# EasyEDA Pro project FOC的开关电源模块.eprj

# Schematic Schematic1
Board Name: Board1; Create Date: 2024-10-08; Page Name: P1; Project Name: FOC的开关电源模块; Schematic Name: Schematic1; Update Date: 2024-10-20; Company: 嘉立创EDA; Page Size: A4; Version: V1.0
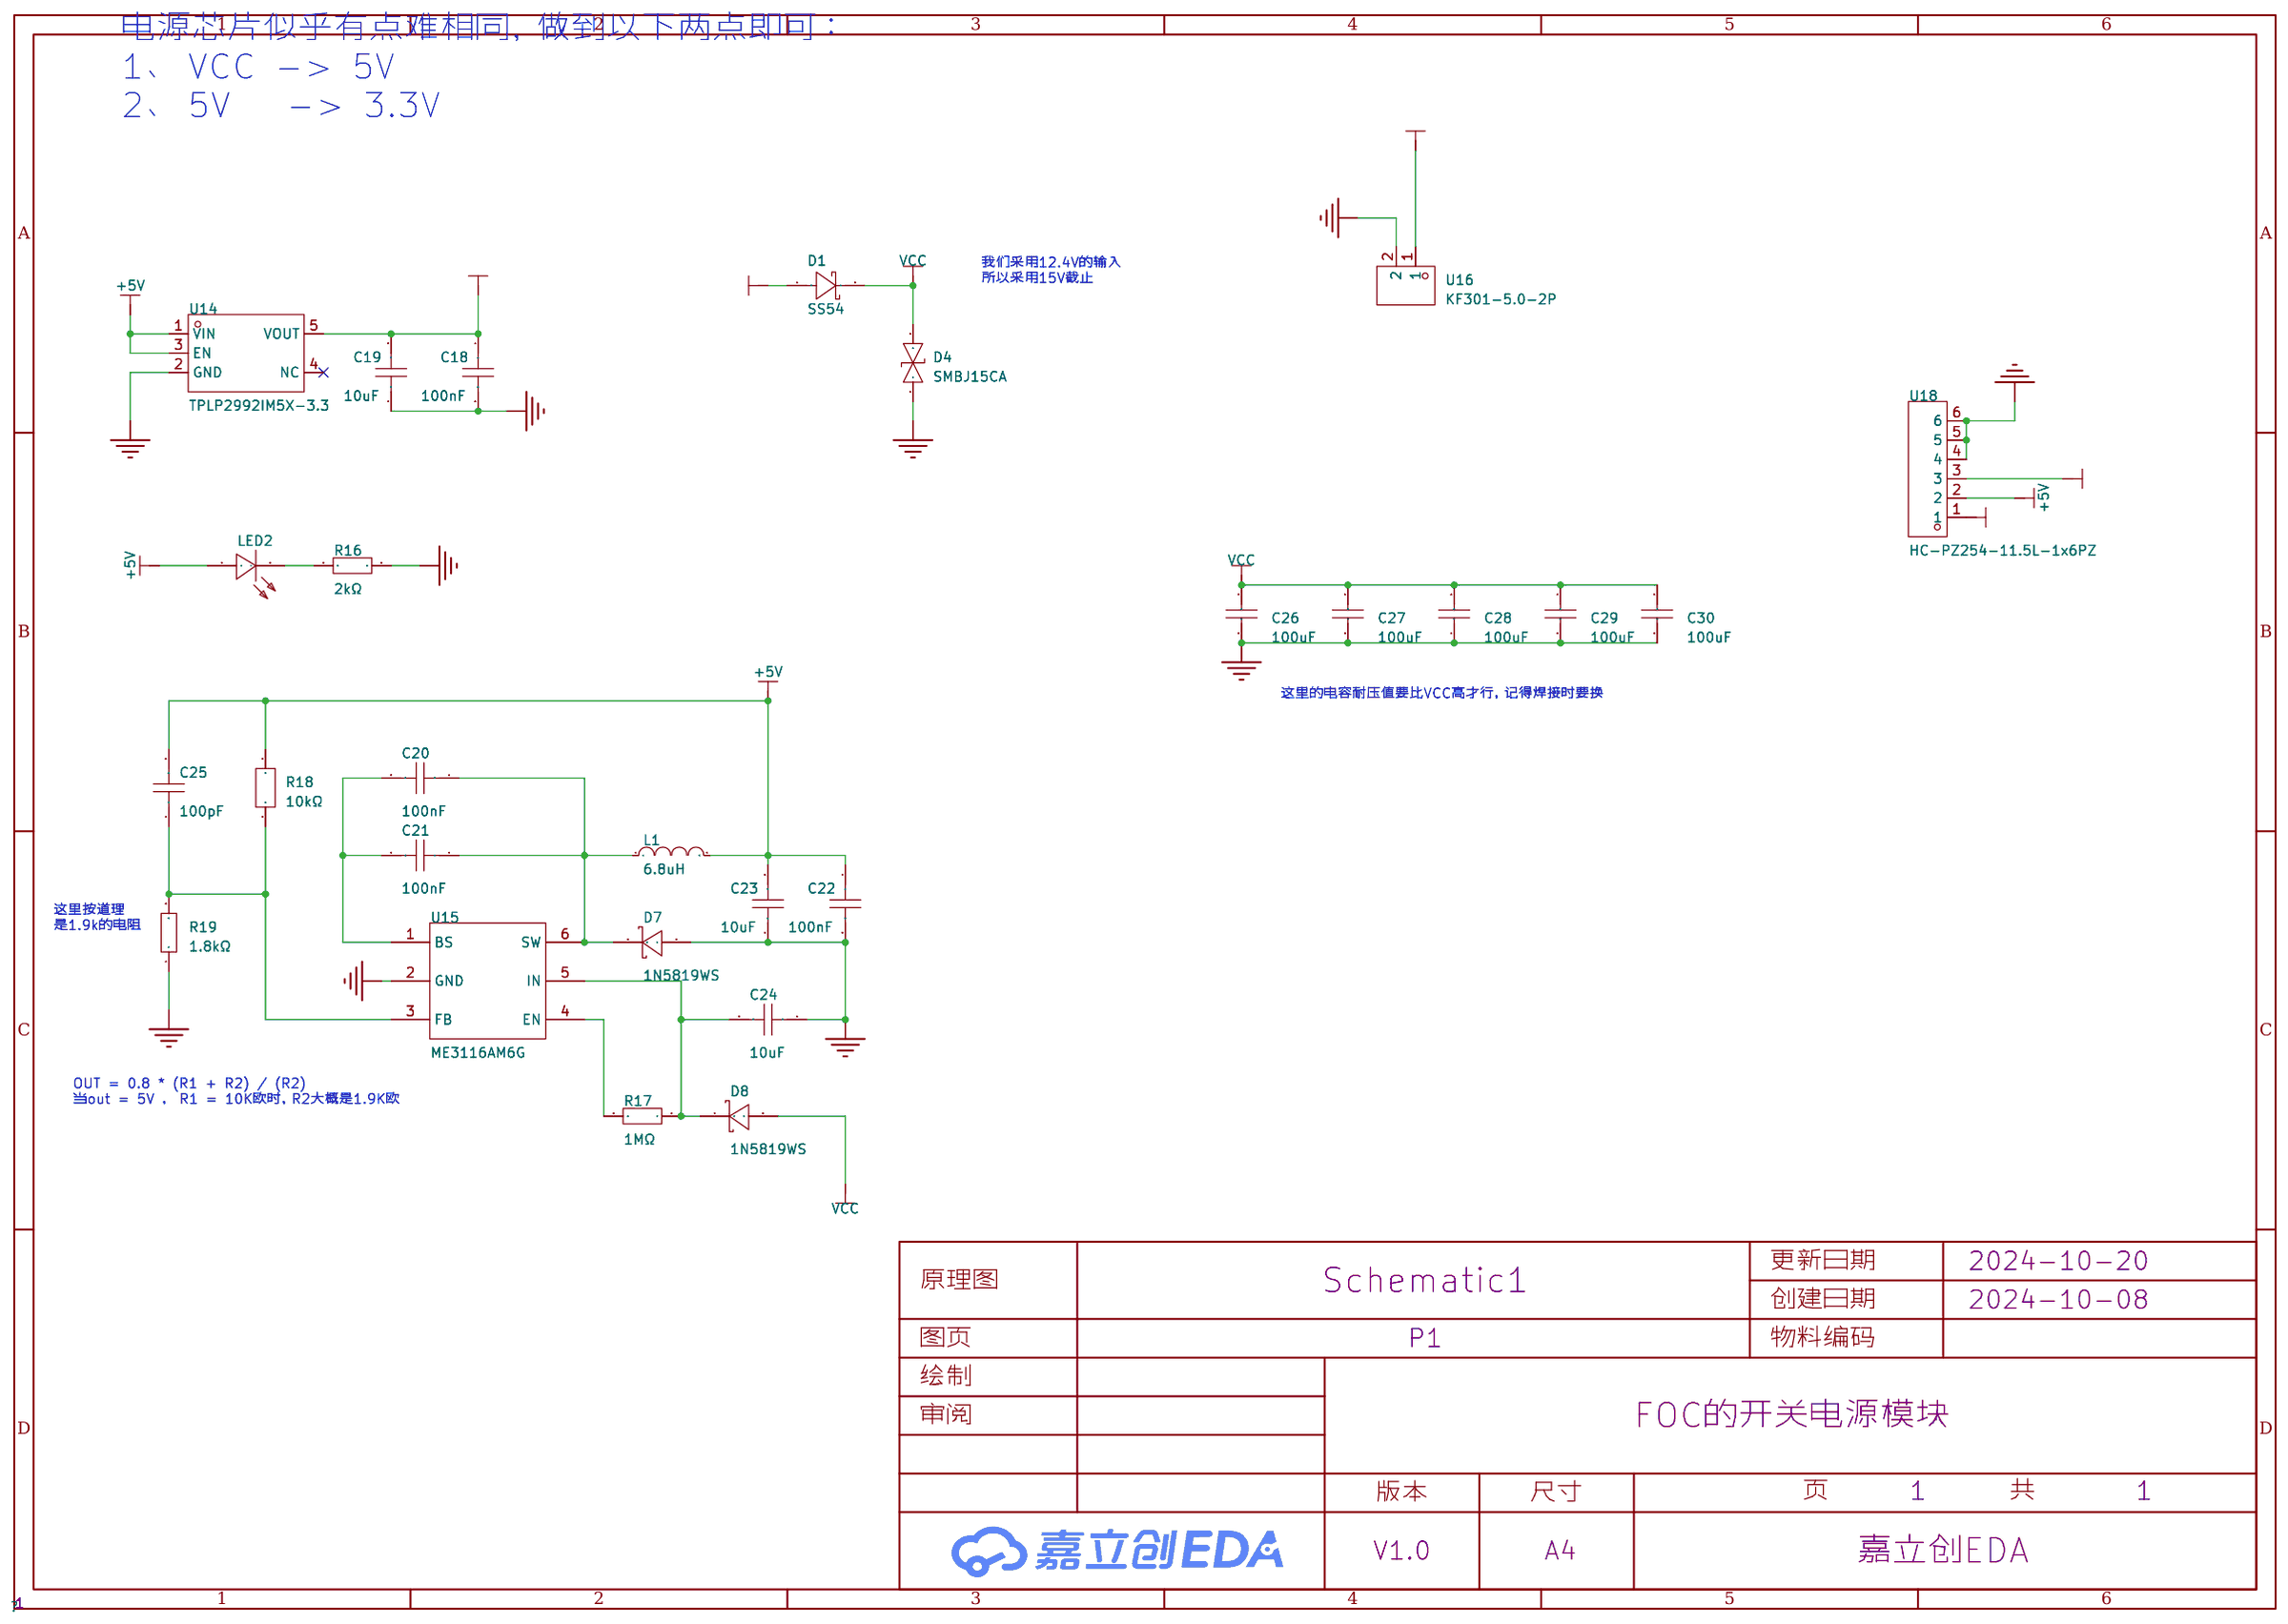
[diagram p0: schematic sheet]

## Parts
C18  100nF  [C0603]
C19  10uF  [C0603]
C20  100nF  [C0603]
C21  100nF  [C0603]
C22  100nF  [C0603]
C23  10uF  [C0603]
C24  10uF  [C0603]
C25  100pF  [C0603]
C26  100uF  [C1206]
C27  100uF  [C1206]
C28  100uF  [C1206]
C29  100uF  [C1206]
C30  100uF  [C1206]
D1  SS54  [SMA_L4.3-W2.6-LS5.0-FD]
D4  SMBJ15CA  [SMB_L4.6-W3.6-LS5.3-BI]
D7  1N5819WS  [SOD-323_L1.8-W1.3-LS2.5-RD]
D8  1N5819WS  [SOD-323_L1.8-W1.3-LS2.5-RD]
L1  6.8uH  [IND-SMD_L3.2-W2.5_L3225]
LED2  SZYY0805G  [LED0805-R-RD]
R16  2kΩ  [R0603]
R17  1MΩ  [R0603]
R18  10kΩ  [R0603]
R19  1.8kΩ  [R0603]
U14  TPLP2992IM5X-3.3  [SOT-23-5_L2.9-W1.6-P0.95-LS2.8-BL]
U15  ME3116AM6G  [SOT-23-6_L2.9-W1.6-P0.95-LS2.8-BL]
U16  KF301-5.0-2P  [CONN-TH_P5.00_KF301-5.0-2P]
U18  HC-PZ254-11.5L-1x6PZ  [hdr-th_6p-p2.54-v-f]

## Library data of the parts
C18 C20-C22 = CGA0603X7R104K500JT: 容值:100nF;精度:±10%;额定电压:50V;材质(温度系数):X7R;; LCSC Part Name: 100nF ±10% 50V; Supplier Part: C6119867; Manufacturer: HRE(芯声); Supplier Footprint: 0603; JLCPCB Part Class: 扩展库; Supplier: LCSC; Tolerance: ±10%; Voltage Rated: 50V; Temperature Coefficient: X7R
C19 C23 C24 = GRM188R6YA106MA73D: 容值:10uF;精度:±20%;额定电压:35V;材质(温度系数):X5R;; LCSC Part Name: 10uF ±20% 35V; Supplier Part: C194427; Manufacturer: muRata(村田); Supplier Footprint: 0603; JLCPCB Part Class: 扩展库; Datasheet: https://atta.szlcsc.com/upload/public/pdf/source/20210128/C194427_FCA3640823207DDB58700A82F1A19B5F.pdf; Supplier: LCSC; Tolerance: ±20%; Voltage Rated: 35V; Temperature Coefficient: X5R
C25 = CC0603JRNPO9BN101: 容值:100pF;精度:±5%;额定电压:50V;材质(温度系数):NP0;; LCSC Part Name: 100pF ±5% 50V; Supplier Part: C14665; Manufacturer: YAGEO(国巨); Supplier Footprint: 0603; JLCPCB Part Class: 扩展库; Datasheet: https://atta.szlcsc.com/upload/public/pdf/source/20181008/C309499_21CC21451B82C39E3D92150FD6B30293.pdf; Supplier: LCSC; Tolerance: ±5%; Voltage Rated: 50V; Temperature Coefficient: NP0
C26-C30 = C3216X5R1A107MT0A0E: 容值:100uF;精度:±20%;额定电压:10V;材质(温度系数):X5R;; LCSC Part Name: 100uF ±20% 10V; Supplier Part: C76656; Manufacturer: TDK; Supplier Footprint: 1206; JLCPCB Part Class: 扩展库; Datasheet: https://atta.szlcsc.com/upload/public/pdf/source/20191009/C435256_A698304126E0DD2EAD15F9D05758F127.pdf; Supplier: LCSC; Tolerance: ±20%; Voltage Rated: 10V; Temperature Coefficient: X5R
D1 = SS54_C7420369: 二极管配置:独立式;正向压降(Vf):550mV@5.0A;直流反向耐压(Vr):40V;整流电流:5A;; LCSC Part Name: 电压:40V 电流:5A; Supplier Part: C7420369; Manufacturer: 宏迦橙; Supplier Footprint: SMA(DO-214AC); JLCPCB Part Class: 扩展库; Datasheet: https://atta.szlcsc.com/upload/public/pdf/source/20230828/254C3882F8647358AD9F60DD73611B5E.pdf; Supplier: LCSC; Diode Configuration: 独立式; Forward Voltage (Vf@If): 550mV@5.0A; Reverse Voltage (Vr): 40V; Rectified Current: 5A; Reverse Leakage Current (Ir): 50uA@40V
D4 = SMBJ15CA_C113989: 极性:单向;反向截止电压(Vrwm):15V;最大钳位电压:24.4V;峰值脉冲电流(Ipp)@10/1000us:24A;击穿电压:16.7V;; LCSC Part Name: TVS 15V截止 24.6A峰值脉冲; Supplier Part: C113989; Manufacturer: MDD; Supplier Footprint: SMB(DO-214AA); JLCPCB Part Class: 扩展库; Datasheet: https://atta.szlcsc.com/upload/public/pdf/source/20230314/C8F66EF07395B88C11214ABD10019202.pdf; Supplier: LCSC; polarity: 单向; Reverse Stand-Off Voltage (Vrwm): 15V; Maximum Clamping Voltage: 24.4V; Peak Pulse Current (Ipp)@10/1000us: 24A; Breakdown Voltage: 16.7V; Type: TVS
D7 D8 = 1N5819WS_C191023: 正向压降(Vf):600mV@1A;直流反向耐压(Vr):40V;平均整流电流(Io):1A;; LCSC Part Name: 电压:40V 电流:1A; Supplier Part: C191023; Manufacturer: Hottech(合科泰); Supplier Footprint: SOD-323; JLCPCB Part Class: 基础库; Datasheet: https://atta.szlcsc.com/upload/public/pdf/source/20220428/3CB86FD8D28D653594B4E35F9D5AEFD9.pdf; Supplier: LCSC; Forward Voltage (Vf@If): 600mV@1A; Reverse Voltage (Vr): 40V; Average Rectified Current (Io): 1A
L1 = CMI322513X6R8KT: 电感值:6.8uH;精度:±10%;额定电流:450mA;饱和电流(Isat):-;直流电阻(DCR):600mΩ;; LCSC Part Name: 6.8uH ±10%; Supplier Part: C394999; Manufacturer: FH(风华); Supplier Footprint: 1210; JLCPCB Part Class: 扩展库; Datasheet: https://atta.szlcsc.com/upload/public/pdf/source/20230223/556F0AE4A9B979D2FCCAA2181251BD1D.pdf; Supplier: LCSC; Tolerance: ±10%; Rated Current: 450mA; DC Resistance (DCR): 600mΩ; Q @ Freq: 35@4MHz; Frequency - Self Resonant: 20MHz
LED2 = SZYY0805G: 发光颜色:翠绿色;; LCSC Part Name: 翠绿; Supplier Part: C434432; Manufacturer: yongyu(永裕光电); Supplier Footprint: 0805; JLCPCB Part Class: 扩展库; Datasheet: https://atta.szlcsc.com/upload/public/pdf/source/20191204/C434432_9975307E99FEDF79FC6902370AFE95E6.pdf; Supplier: LCSC; Emitted Color: 翠绿色
R16 = 0603WAF2001T5E: 电阻类型:厚膜电阻;阻值:2kΩ;精度:±1%;功率:100mW;最大工作电压:75V;温度系数:±100ppm/℃;; LCSC Part Name: 2kΩ ±1% 100mW 厚膜电阻; Supplier Part: C22975; Manufacturer: UNI-ROYAL(厚声); Supplier Footprint: 0603; JLCPCB Part Class: 基础库; Datasheet: https://atta.szlcsc.com/upload/public/pdf/source/20200306/C422600_1E6D84923E4A46A82E41ADD87F860B5C.pdf; Supplier: LCSC; Type: 厚膜电阻; Tolerance: ±1%; Power(Watts): 100mW; Overload Voltage (Max): 75V; Temperature Coefficient: ±100ppm/℃; Operating Temperature Range: -55℃~+155℃
R17 = 0603WAF1004T5E: 电阻类型:厚膜电阻;阻值:1MΩ;精度:±1%;功率:100mW;最大工作电压:75V;温度系数:±100ppm/℃;; LCSC Part Name: 1MΩ ±1% 100mW 厚膜电阻; Supplier Part: C22935; Manufacturer: UNI-ROYAL(厚声); Supplier Footprint: 0603; JLCPCB Part Class: 基础库; Datasheet: https://atta.szlcsc.com/upload/public/pdf/source/20200306/C422600_1E6D84923E4A46A82E41ADD87F860B5C.pdf; Supplier: LCSC; Type: 厚膜电阻; Tolerance: ±1%; Power(Watts): 100mW; Overload Voltage (Max): 75V; Temperature Coefficient: ±100ppm/℃; Operating Temperature Range: -55℃~+155℃
R18 = FRC0603J103TS: 电阻类型:厚膜电阻;阻值:10kΩ;精度:±5%;功率:100mW;最大工作电压:75V;温度系数:±100ppm/℃;; LCSC Part Name: 10kΩ ±5% 100mW 厚膜电阻; Supplier Part: C2930027; Manufacturer: FOJAN(富捷); Supplier Footprint: 0603; JLCPCB Part Class: 扩展库; Datasheet: https://atta.szlcsc.com/upload/public/pdf/source/20211221/925EC7D7225764EE0046F22065062C87.pdf; Supplier: LCSC; Type: 厚膜电阻; Tolerance: ±5%; Power(Watts): 100mW; Overload Voltage (Max): 75V; Temperature Coefficient: ±100ppm/℃; Operating Temperature Range: -55℃~+155℃
R19 = 0603WAF1801T5E: 电阻类型:厚膜电阻;阻值:1.8kΩ;精度:±1%;功率:100mW;最大工作电压:75V;温度系数:±100ppm/℃;; LCSC Part Name: 1.8kΩ ±1% 100mW 厚膜电阻; Supplier Part: C4177; Manufacturer: UNI-ROYAL(厚声); Supplier Footprint: 0603; JLCPCB Part Class: Basic Part; Datasheet: https://atta.szlcsc.com/upload/public/pdf/source/20200306/C422600_1E6D84923E4A46A82E41ADD87F860B5C.pdf; Supplier: LCSC; Type: 厚膜电阻; Tolerance: ±1%; Power(Watts): 100mW; Overload Voltage (Max): 75V; Temperature Coefficient: ±100ppm/℃; Operating Temperature Range: -55℃~+155℃
U14 = TPLP2992IM5X-3.3: Supplier Part: C5370974; Manufacturer: TECH PUBLIC(台舟); Supplier Footprint: SOT-23-5; JLCPCB Part Class: 扩展库; Datasheet: https://atta.szlcsc.com/upload/public/pdf/source/20231102/A2433F3D50E57F58FFEDA8CC7F50340E.pdf; Supplier: LCSC
U15 = ME3116AM6G_C97643: 功能类型:降压型;输入电压:-;输出电流(最大值):-;; Supplier Part: C97643; Manufacturer: MICRONE(南京微盟); Supplier Footprint: SOT-23-6; JLCPCB Part Class: 扩展库; Datasheet: https://atta.szlcsc.com/upload/public/pdf/source/20170322/1490151692992.pdf; Supplier: LCSC; Function: 降压型; Switch tube (built-in/external): 内置
U16 = KF301-5.0-2P: 结构:1x2P;间距:5mm;颜色:蓝色;安装方式:直插;额定电流:17A;额定电压:250V;排数:1;线规 - AWG:14~22;线规 - 平方毫米:1.5;每排PIN数:2;工作温度范围:-30℃~+120℃;; LCSC Part Name: 5mm 1x2P 排数:1 每排P数:2 直插; Supplier Part: C474881; Manufacturer: KEFA(科发); Supplier Footprint: 插件,P=5mm; JLCPCB Part Class: 扩展库; Datasheet: https://atta.szlcsc.com/upload/public/pdf/source/20230317/03A5B5FC229D6F9225E8F51DA1A4E80A.pdf; Supplier: LCSC; Structure: 1x2P; Pitch: 5mm; Color: 蓝色; Mounting Style: 直插; Current Rating (Max): 17A; Voltage Rating (Max): 250V; Number of Pins: 2P; Number of Rows: 1; Wire Gauge - AWG: 14~22; Wire Gauge - mm2: 1.5; Number of PINs Per Row: 2; Operating Temperature Range: -30℃~+120℃
U18 = HC-PZ254-11.5L-1x6PZ: LCSC Part Name: 间距2.54mm 1x6Pin 直插 H2.5 L11.5; Supplier Part: C27985191; Manufacturer: HC(虹成电子); Supplier Footprint: 插件,P=2.54mm; JLCPCB Part Class: 扩展库; Datasheet: https://atta.szlcsc.com/upload/public/pdf/source/20240710/781FF9BA49CA1226687420E2ED416FCE.pdf; Supplier: LCSC; Pin Structure: 1x6P; Pitch: 2.54mm; Circluar Pins/Square Pins: 方针; Mounting Type: 直插; Number of Rows: 单排; Number of Pins: 6P; Current Rating (Max): 3A; Length of Mating Pin: 6mm; Insulation Height: 2.5mm; Length of End Connection Pin: 3mm; Contact Material: 黄铜; Contact Plating: 金; Operating Temperature Range: -40℃~+105℃; Soldering Temperature(Max): 260℃; Color: 黑色

## Nets
3V3: C18.1 C19.2 U14.5(VOUT) U18.3
+5V: C22.1 C23.2 C25.2 L1.2 LED2.1(+) R18.2 U14.1(VIN) U14.3(EN) U18.2
GND: C18.2 C19.1 C22.2 C23.1 C24.1 C26.1 C27.1 C28.1 C29.1 C30.1 D4.1 D7.2(A) R16.2 R19.1 U14.2(GND) U15.2(GND) U16.2 U18.4 U18.5 U18.6
VCC: C26.2 C27.2 C28.2 C29.2 C30.2 D1.2(K) D4.2 D8.2(A) U18.1
VCC_IN: D1.1(A) U16.1
$1N1248: LED2.2(-) R16.1
$1N1254: C20.2 C21.2 U15.1(BS)
$1N1255: C20.1 C21.1 D7.1(K) L1.1 U15.6(SW)
$1N1257: R17.2 U15.4(EN)
$1N1258: C24.2 D8.1(K) R17.1 U15.5(IN)
$1N1261: C25.1 R18.1 R19.2 U15.3(FB)

Not connected (* = marked no-connect by the designer): U14 4(NC)*

## Notes on the sheet
- 电源芯片似乎有点难相同，做到以下两点即可：
  1、 VCC -> 5V
  2、 5V   -> 3.3V
- 我们采用12.4V的输入
  所以采用15V截止
- 这里的电容耐压值要比VCC高才行，记得焊接时要换
- 这里按道理
  是1.9k的电阻
- OUT = 0.8 * (R1 + R2) / (R2)
  当out = 5V ， R1 = 10K欧时，R2大概是1.9K欧

# Board PCB1
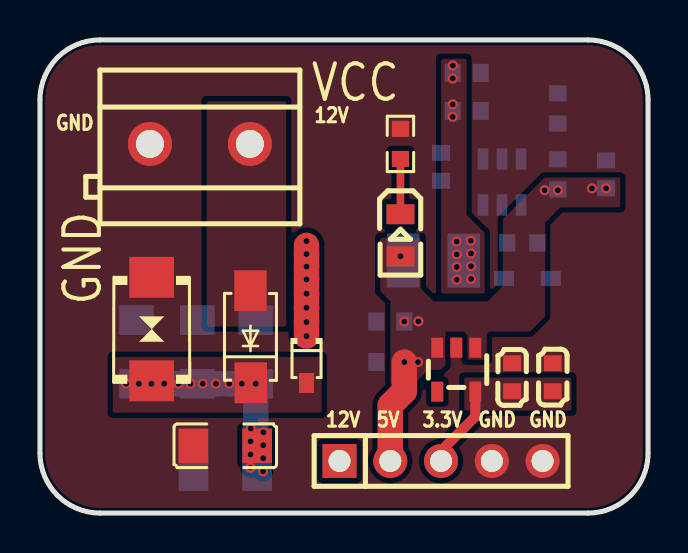
[diagram p1: board, top side]
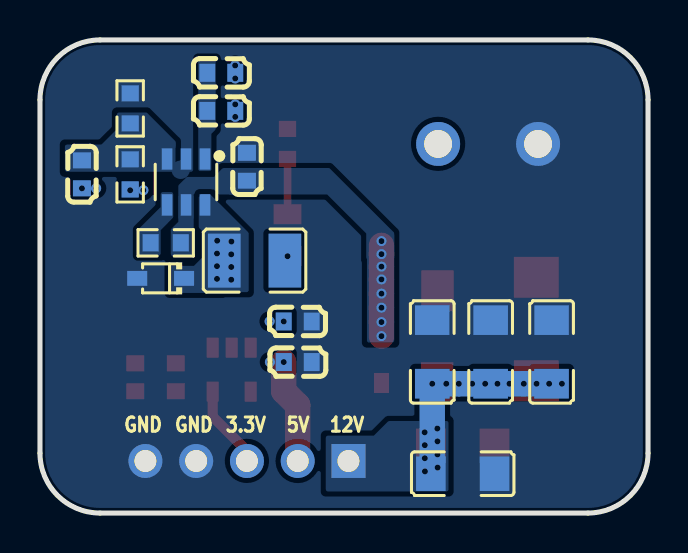
[diagram p2: board, bottom side, seen from below]

Outline 30.42 x 23.69 mm; copper layers: Top Layer, Bottom Layer. Coordinates in mm from the lower left corner of the outline.
Outline path: 0,20.69 0,3 arc(0.88,0.88) 3,0 27.42,0 arc(29.54,0.88) 30.42,3 30.42,20.69 arc(29.54,22.81) 27.42,23.69 3,23.69 arc(0.88,22.81) 0,20.69
Stack: Top Layer 0.035mm / Dielectric1 1.51mm FR4 er 4.5 / Bottom Layer 0.035mm

## Design rules (mm)
template: 自定义配置
spacing copperThickness1oz (default): track to track 0.102, other pairs 0.152 to 0.3
spacing copperThickness2oz: track to track 0.203, other pairs 0.152 to 0.3
track width copperThickness1oz (default): min 0.127, default 0.254, max 2.54
track width copperThickness2oz: min 0.203, default 0.254, max 2.54
differential pair differentialPair (default): width min 0.127, default 0.254, max 2.54; gap min 0.152, default 0.152
via viaSize (default): diameter min 0.5, default 0.503, max 10; hole min 0.3, default 0.302, max 6.299

## Placement (name value [footprint] x y rotation side)
C18  100nF  [C0603]  23.62 6.8 90 top
C19  10uF  [C0603]  25.65 6.8 270 top
C20  100nF  [C0603]  21.35 20.14 0 bottom
C21  100nF  [C0603]  21.35 22.04 0 bottom
C22  100nF  [C0603]  17.53 9.59 180 bottom
C23  10uF  [C0603]  17.53 7.56 0 bottom
C24  10uF  [C0603]  20.07 17.34 270 bottom
C25  100pF  [C0603]  28.32 16.96 270 bottom
C26  100uF  [C1206]  4.83 8.07 270 bottom
C27  100uF  [C1206]  7.87 8.07 270 bottom
C28  100uF  [C1206]  9.27 1.97 0 bottom
C29  100uF  [C1206]  10.79 8.07 270 bottom
C30  100uF  [C1206]  9.27 3.37 0 top
D1  SS54  [SMA_L4.3-W2.6-LS5.0-FD]  10.54 8.83 270 top
D4  SMBJ15CA  [SMB_L4.6-W3.6-LS5.3-BI]  5.59 9.21 270 top
D7  1N5819WS  [SOD-323_L1.8-W1.3-LS2.5-RD]  24.38 11.75 0 bottom
D8  1N5819WS  [SOD-323_L1.8-W1.3-LS2.5-RD]  13.34 7.69 270 top
H1  PZ254V-11-05P  [HDR-TH_5P-P2.54-V-M]  20.07 2.61 0 top
L1  6.8uH  [IND-SMD_L3.2-W2.5_L3225]  19.69 12.64 180 bottom
LED2  SZYY0805G  [LED0805-R-RD]  18.03 13.91 270 top
R16  2kΩ  [R0603]  18.03 18.48 90 top
R17  1MΩ  [R0603]  24.13 13.53 0 bottom
R18  10kΩ  [R0603]  25.91 16.96 270 bottom
R19  1.8kΩ  [R0603]  25.91 20.26 270 bottom
U14  TPLP2992IM5X-3.3  [SOT-23-5_L2.9-W1.6-P0.95-LS2.8-BL]  20.83 7.18 180 top
U15  ME3116AM6G  [SOT-23-6_L2.9-W1.6-P0.95-LS2.8-BL]  23.11 16.58 0 bottom
U16  KF301-5.0-2P  [CONN-TH_P5.00_KF301-5.0-2P]  8 18.48 180 top

## Footprints (pads in the part's own frame, mm; a bottom-side part is the same pattern mirrored in y, then rotated)
C0603
  rect 0.8x0.9 smd: 1(-0.7,0) 2(0.7,0)
C1206
  rect 1.485x1.728 smd: 1(-1.593,0) 2(1.593,0)
CONN-TH_P5.00_KF301-5.0-2P
  round 2.2 hole 1.4: 1(-2.5,0) 2(2.5,0)
HDR-TH_5P-P2.54-V-M
  rect 1.7x1.7 hole 1.1: 1(-5.08,0)
  round 1.7 hole 1.1: 2(-2.54,0) 3(0,0) 4(2.54,0) 5(5.08,0)
IND-SMD_L3.2-W2.5_L3225
  rect 1.635x2.7 smd: 1(-1.518,0) 2(1.518,0)
LED0805-R-RD
  rect 1x1.399 smd: 1(1.05,0) 2(-1.05,0)
R0603
  rect 0.806x0.864 smd: 1(-0.753,0) 2(0.753,0)
SMA_L4.3-W2.6-LS5.0-FD
  rect 2.046x1.62 smd: 1(-2.304,-0.009) 2(2.304,0.009)
SMB_L4.6-W3.6-LS5.3-BI
  rect 2.047x2.241 smd: 1(-2.591,0) 2(2.591,0)
SOD-323_L1.8-W1.3-LS2.5-RD
  rect 1x0.75 smd: 1(-1.173,0) 2(1.173,0)
SOT-23-5_L2.9-W1.6-P0.95-LS2.8-BL
  rect 0.6x1 smd: 1(-0.95,-1.1) 2(0,-1.1) 3(0.95,-1.1) 4(0.95,1.1) 5(-0.95,1.1)
SOT-23-6_L2.9-W1.6-P0.95-LS2.8-BL
  rect 0.532x1.072 smd: 1(-0.95,-1.149) 2(0,-1.149) 3(0.95,-1.149) 4(0.95,1.149) 5(0,1.149) 6(-0.95,1.149)

## Nets
3V3: C18.1 C19.2 H1.3 U14.5
+5V: C22.1 C23.2 C25.2 H1.2 L1.2 LED2.1 R18.2 U14.1 U14.3
GND: C18.2 C19.1 C22.2 C23.1 C24.1 C26.1 C27.1 C28.1 C29.1 C30.1 D4.1 D7.2 H1.4 H1.5 R16.2 R19.1 U14.2 U15.2 U16.2
VCC: C26.2 C27.2 C28.2 C29.2 C30.2 D1.2 D4.2 D8.2 H1.1
VCC_IN: D1.1 U16.1
$1N1248: LED2.2 R16.1
$1N1254: C20.2 C21.2 U15.1
$1N1255: C20.1 C21.1 D7.1 L1.1 U15.6
$1N1257: R17.2 U15.4
$1N1258: C24.2 D8.1 R17.1 U15.5
$1N1261: C25.1 R18.1 R19.2 U15.3

Pads without a net: U14 4

## Via types
v1: diameter 0.503, hole 0.302, Top Layer to Bottom Layer, 48 vias

## Routing (per net, layer and track width the routed paths; a pad name or vN(x,y) marks a point on that pad's centre or on a via; arc(x,y) is an arc through that point)
3V3: length 4.2
  Top Layer w0.508: H1.3 20.07,3.11 21.78,4.83 U14.5
+5V: length 5.2
  Top Layer w1.27: H1.2 17.53,5.4 18.23,6.1 v1(18.23,7.56)
  vias: v1(18.03,12.86) v1(18.23,9.59) v1(18.93,9.6) v1(18.92,7.56) v1(25.25,16.16) v1(25.91,16.16) v1(27.61,16.26) v1(28.32,16.26)
VCC: length 10.1
  Bottom Layer w1.27: v1(4.95,6.48) v1(5.58,6.48) v1(6.22,6.48) v1(6.93,6.48) v1(7.53,6.48) C27.2 v1(8.15,6.48) v1(8.8,6.48) v1(9.47,6.48) v1(10.09,6.48) v1(10.79,6.48) 10.79,2.28 10.81,2.28
  vias: v1(4.31,6.48) v1(10.54,4.23) v1(10.53,3.59) v1(10.53,2.93) v1(10.53,2.28) v1(11.18,4.04) v1(11.17,3.4) v1(11.17,2.74) v1(11.16,2.09)
$1N1248: length 2.8
  Top Layer w0.381: R16.1 LED2.2
$1N1255:
  vias: v1(20.66,22.41) v1(20.65,21.76) v1(20.65,20.46) v1(20.65,19.84) v1(20.84,13.6) v1(20.85,12.95) v1(20.85,12.32) v1(20.85,11.68) v1(21.56,13.64) v1(21.56,13) v1(21.56,12.36) v1(21.56,11.73)
$1N1258: length 4.5
  Top Layer w1.27: 13.34,13.4 v1(13.34,12.96) v1(13.34,12.34) v1(13.34,11.7) v1(13.34,10.99) v1(13.34,10.28) v1(13.34,9.56) v1(13.34,8.86)
  vias: v1(13.34,13.62)

## Copper pours and planes (outline as drawn; the poured copper is in the pictures)
3V3 on Top Layer: 21.23,6.79 21.23,5.12 26.59,5.12 26.59,6.78 26.57,6.79
+5V on Top Layer: 21.34,7.69 21.34,8.96 21.08,9.21 21.08,9.34 22.71,9.34 22.71,9.32 22.35,8.96 22.35,7.67 21.35,7.67
+5V on Top Layer: 17.02,13.78 17.02,11.12 17.53,10.61 17.53,6.47 18.72,6.47 19.43,7.18 20.06,7.18 20.3,7.42 20.3,9.08 24.51,9.08 25.27,9.85 25.27,14.54 26.03,15.31 29.03,15.31 29.03,16.78 29.01,16.81 25.24,16.81 23.16,14.72 23.16,11.37 22.39,10.61 19.69,10.61 19.05,11.24 19.05,13.78
GND on Top Layer: 0,23.69 30.73,23.69 30.73,-0.31 0,-0.31
GND on Bottom Layer: -0.04,23.69 30.73,23.69 30.73,-0.31 -0.04,-0.31
VCC on Top Layer: 3.64,7.82 14.1,7.82 14.1,5.02 3.64,5.02
VCC on Bottom Layer: 16.12,3.88 16.12,1.08 9.98,1.08 9.98,4.61 12.98,4.61 13.72,3.88
VCC_IN on Top Layer: 8.34,20.63 12.32,20.63 12.32,9.34 8.34,9.34
$1N1254 on Bottom Layer: 21.63,22.75 21.63,19.2 21.84,18.99 21.84,17.12 22.5,17.12 22.5,22.75
$1N1255 on Top Layer: 21.34,22.75 21.34,14.94 22.21,14.07 22.25,14.07 22.25,10.99 20.07,10.99 20.07,22.75
$1N1255 on Bottom Layer: 21.84,15.99 22.48,15.99 22.48,14.3 22.25,14.07 22.25,11.06 19.98,11.06 19.98,14.04 21.84,15.9
$1N1255 on Bottom Layer: 22.25,12.85 22.72,12.38 23.94,12.38 23.94,11.02 21.3,11.02 21.21,11.12 21.21,12.85 21.21,12.85
$1N1257 on Bottom Layer: 23.75,16.07 23.75,14.8 24.38,14.16 24.38,12.89 25.51,12.89 25.51,14.19 24.38,15.32 24.38,16.07
$1N1258 on Bottom Layer: 23.5,14.67 22.73,14.67 22.73,15.94 22.48,16.2 20.71,16.2 20.71,16.83 23.07,16.83 23.5,16.41
$1N1258 on Bottom Layer: 20.51,17.28 21.27,17.28 21.72,16.83 21.72,16.2 21.47,15.95 20.51,15.95
$1N1258 on Bottom Layer: 22.73,15.94 22.73,12.87 23.85,12.87 23.88,12.89 23.88,14.2 23.5,14.58 23.5,15.94
$1N1258 on Bottom Layer: 12.7,12.69 14.1,12.69 14.1,14 16.05,15.95 20.99,15.95 20.99,17.28 15.94,17.28 12.7,14.04
$1N1258 on Bottom Layer: 12.7,14.04 14.06,14.04 14.06,8.54 12.7,8.54
$1N1261 on Bottom Layer: 23.62,17.08 29.17,17.08 29.17,18.45 27.34,18.45 26.57,19.22 26.57,20.05 25.08,20.05 23.63,18.61 23.62,18.61

## Text on the board
Bottom Silkscreen Layer: 12V | 5V | 3.3V | GND
Top Silkscreen Layer: GND | 12V | 5V | 3.3V | VCC

# Board PCB1_1
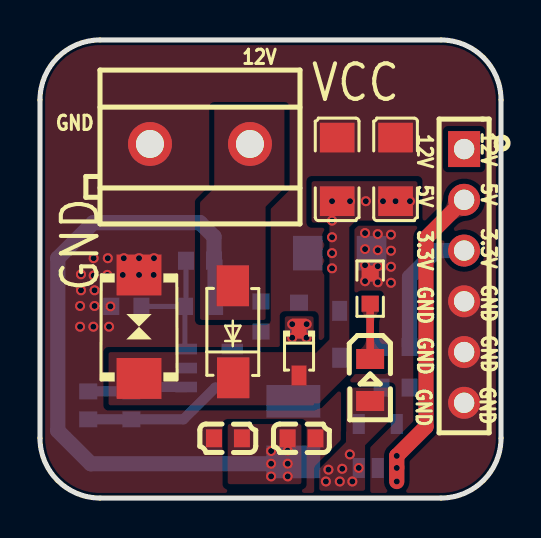
[diagram p3: board, top side]
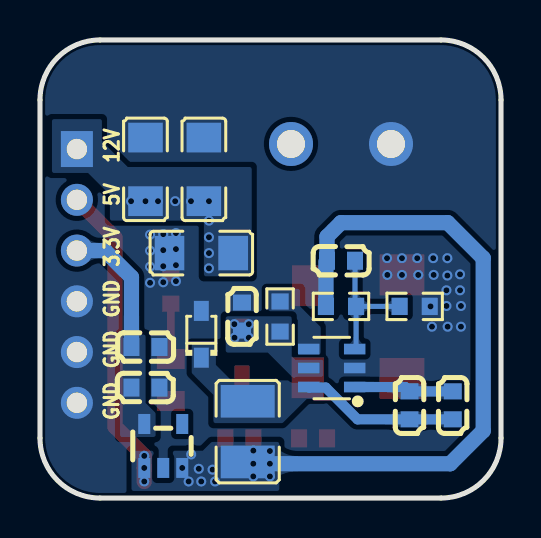
[diagram p4: board, bottom side, seen from below]

Outline 23.05 x 22.93 mm; copper layers: Top Layer, Bottom Layer. Coordinates in mm from the lower left corner of the outline.
Outline path: 0,19.93 0,3 arc(0.88,0.88) 3,0 20.05,0 arc(22.18,0.88) 23.05,3 23.05,19.93 arc(22.18,22.05) 20.05,22.93 3,22.93 arc(0.88,22.05) 0,19.93
Stack: Top Layer 0.035mm / Dielectric1 1.51mm FR4 er 4.5 / Bottom Layer 0.035mm

## Design rules (mm)
template: 自定义配置
spacing copperThickness1oz (default): track to track 0.102, other pairs 0.152 to 0.3
spacing copperThickness2oz: track to track 0.203, other pairs 0.152 to 0.3
track width copperThickness1oz (default): min 0.127, default 0.254, max 2.54
track width copperThickness2oz: min 0.203, default 0.254, max 2.54
differential pair differentialPair (default): width min 0.127, default 0.254, max 2.54; gap min 0.152, default 0.152
via viaSize (default): diameter min 0.5, default 0.503, max 10; hole min 0.3, default 0.302, max 6.299

## Placement (name value [footprint] x y rotation side)
C18  100nF  [C0603]  17.78 5.53 180 bottom
C19  10uF  [C0603]  17.78 7.56 0 bottom
C20  100nF  [C0603]  4.57 4.64 90 bottom
C21  100nF  [C0603]  2.41 4.64 90 bottom
C22  100nF  [C0603]  13.08 2.99 0 top
C23  10uF  [C0603]  9.4 2.99 0 top
C24  10uF  [C0603]  12.95 9.08 270 bottom
C25  100pF  [C0603]  8 11.88 0 bottom
C26  100uF  [C1206]  17.78 16.45 270 top
C27  100uF  [C1206]  14.86 16.45 270 top
C28  100uF  [C1206]  17.78 16.45 270 bottom
C29  100uF  [C1206]  14.86 16.45 270 bottom
C30  100uF  [C1206]  14.99 12.26 180 bottom
D1  SS54  [SMA_L4.3-W2.6-LS5.0-FD]  9.65 8.32 270 top
D4  SMBJ15CA  [SMB_L4.6-W3.6-LS5.3-BI]  4.95 8.58 270 top
D7  1N5819WS  [SOD-323_L1.8-W1.3-LS2.5-RD]  14.99 8.2 90 bottom
D8  1N5819WS  [SOD-323_L1.8-W1.3-LS2.5-RD]  12.95 7.31 270 top
L1  6.8uH  [IND-SMD_L3.2-W2.5_L3225]  12.67 3.32 270 bottom
LED2  SZYY0805G  [LED0805-R-RD]  16.51 5.91 270 top
R16  2kΩ  [R0603]  16.51 10.48 90 top
R17  1MΩ  [R0603]  11.05 9.08 90 bottom
R18  10kΩ  [R0603]  8 9.59 0 bottom
R19  1.8kΩ  [R0603]  4.32 9.59 0 bottom
U14  TPLP2992IM5X-3.3  [SOT-23-5_L2.9-W1.6-P0.95-LS2.8-BL]  16.89 2.61 180 bottom
U15  ME3116AM6G  [SOT-23-6_L2.9-W1.6-P0.95-LS2.8-BL]  8.47 6.51 90 bottom
U16  KF301-5.0-2P  [CONN-TH_P5.00_KF301-5.0-2P]  8 17.72 180 top
U18  HC-PZ254-11.5L-1x6PZ  [hdr-th_6p-p2.54-v-f]  21.21 11.12 270 top

## Footprints (pads in the part's own frame, mm; a bottom-side part is the same pattern mirrored in y, then rotated)
C0603
  rect 0.8x0.9 smd: 1(-0.7,0) 2(0.7,0)
C1206
  rect 1.485x1.728 smd: 1(-1.593,0) 2(1.593,0)
CONN-TH_P5.00_KF301-5.0-2P
  round 2.2 hole 1.4: 1(-2.5,0) 2(2.5,0)
hdr-th_6p-p2.54-v-f
  rect 1.8x1.6 hole 1.02: 1(-6.35,0)
  round 1.6 hole 1.02: 2(-3.81,0) 3(-1.27,0) 4(1.27,0) 5(3.81,0) 6(6.35,0)
IND-SMD_L3.2-W2.5_L3225
  rect 1.635x2.7 smd: 1(-1.518,0) 2(1.518,0)
LED0805-R-RD
  rect 1x1.399 smd: 1(1.05,0) 2(-1.05,0)
R0603
  rect 0.806x0.864 smd: 1(-0.753,0) 2(0.753,0)
SMA_L4.3-W2.6-LS5.0-FD
  rect 2.046x1.62 smd: 1(-2.304,-0.009) 2(2.304,0.009)
SMB_L4.6-W3.6-LS5.3-BI
  rect 2.047x2.241 smd: 1(-2.591,0) 2(2.591,0)
SOD-323_L1.8-W1.3-LS2.5-RD
  rect 1x0.75 smd: 1(-1.173,0) 2(1.173,0)
SOT-23-5_L2.9-W1.6-P0.95-LS2.8-BL
  rect 0.6x1 smd: 1(-0.95,-1.1) 2(0,-1.1) 3(0.95,-1.1) 4(0.95,1.1) 5(-0.95,1.1)
SOT-23-6_L2.9-W1.6-P0.95-LS2.8-BL
  rect 0.532x1.072 smd: 1(-0.95,-1.149) 2(0,-1.149) 3(0.95,-1.149) 4(0.95,1.149) 5(0,1.149) 6(-0.95,1.149)

## Nets
As in the schematic.

Pads without a net: U14 4

## Via types
v1: diameter 0.503, hole 0.302, Top Layer to Bottom Layer, 61 vias

## Routing (per net, layer and track width the routed paths; a pad name or vN(x,y) marks a point on that pad's centre or on a via; arc(x,y) is an arc through that point)
3V3: length 6.8
  Bottom Layer w0.762: 21.21,12.39 19.81,12.39 18.48,11.05 C19.2
+5V: length 48.9
  Top Layer w0.762: v1(17.84,0.83) v1(17.84,1.51) v1(17.84,2.11) 19.3,3.57 19.3,13.02 U18.2
  Bottom Layer w0.762: R18.2 8.75,11.82 ; C25.2 8.7,13.08 8,13.78 2.67,13.78 0.89,12.01 0.89,3.37 2.54,1.72 v1(11.56,1.72) 12.58,1.72 L1.2
  vias: v1(11.56,2.35) v1(11.56,1.08) v1(12.39,2.37) v1(12.39,1.72) v1(12.39,1.08) v1(14.3,0.83) v1(14.43,1.42) v1(14.99,0.83) v1(15.11,1.46) v1(15.49,2.18) v1(15.62,0.83) v1(15.94,1.51)
GND:
  vias: v1(2.05,11.2) v1(2.05,10.4) v1(2,9.61) v1(2,8.58) v1(2.68,12.01) v1(2.68,11.14) v1(2.73,10.4) v1(2.73,9.61) v1(2.67,8.58) v1(3.39,12.01) v1(3.37,11.17) v1(3.52,9.59) v1(3.45,8.58) v1(4.14,11.17) v1(4.19,12.01) v1(4.95,12.01) v1(4.95,11.17) v1(5.7,12.01) v1(5.68,11.17) v1(16.26,13.26) v1(16.26,12.46) v1(16.26,11.66) v1(16.26,10.85) v1(16.89,13.21) v1(16.89,12.41) v1(16.89,11.6) v1(16.89,10.8) v1(17.55,13.18) v1(17.55,12.38) v1(17.55,11.58) v1(17.55,10.77)
VCC:
  vias: v1(14.6,14.86) v1(14.6,13.89) v1(14.6,13.05) v1(14.6,12.26) v1(14.6,11.5) v1(15.5,14.86) v1(16.29,14.86) v1(17.15,14.86) v1(17.78,14.86) v1(18.5,14.86)
$1N1248: length 2.8
  Top Layer w0.381: R16.1 LED2.2
$1N1254: length 5
  Bottom Layer w0.508: U15.1 4.79,5.56 C20.2 C21.2
$1N1255: length 7.9
  Bottom Layer w0.508: U15.6 9.59,5.53 8.76,5.53 7.17,3.94 C20.1 C21.1
$1N1258:
  vias: v1(12.61,8.7) v1(12.61,8.03) v1(13.34,8.7) v1(13.33,8.03)
$1N1261: length 6.6
  Bottom Layer w0.254: U15.3 7.25,7.53 R18.1 ; 7.3,11.88 7.3,9.65 R18.1 ; R19.2 R18.1

## Copper pours and planes (outline as drawn; the poured copper is in the pictures)
3V3 on Bottom Layer: 17.27,3.06 19.05,3.06 19.05,8.18 17.77,8.18 17.77,4.76 17.27,4.26
+5V on Top Layer: 9.39,3.7 9.39,0.69 13.07,0.69 13.07,3.7 9.4,3.7
+5V on Top Layer: 15.31,5.53 17.52,5.53 17.52,3.92 16.26,2.65 16.26,0.36 13.97,0.36 13.97,1.46 15.31,2.8 15.31,3.32 15.31,3.33
+5V on Bottom Layer: 11.09,2.8 11.09,0.35 18.47,0.35 18.47,2.37 17.38,2.37 17.38,0.86 16.41,0.86 16.41,2.37 14.91,2.37 14.47,2.81 11.1,2.81
GND on Top Layer: -0.38,23.31 23.75,23.31 23.75,-0.69 -0.38,-0.69
GND on Bottom Layer: -0.63,23.44 23.75,23.44 23.75,-0.69 -0.63,-0.69
VCC on Top Layer: 12.23,7.28 12.23,4.73 13.94,4.73 15.47,6.25 15.47,13.55 15.8,13.89 18.87,13.89 18.87,15.86 13.58,15.86 13.58,13.79 13.59,13.78 14.47,13.78 14.47,7.94 13.82,7.28
VCC on Top Layer: 3.43,7.31 13.72,7.31 13.72,4.64 3.43,4.64
VCC on Bottom Layer: 22.46,16.27 20.65,16.27 19.56,15.18 19.56,13.89 14.86,13.89 14.86,11.1 12.47,11.1 12.47,16.57 18.66,16.57 19.96,17.87 19.96,18.97 22.46,18.97
VCC_IN on Top Layer: 8.72,19.56 8.72,15.52 8,14.8 8,8.92 11.28,8.92 11.28,14.58 12.22,15.52 12.22,19.56
$1N1255 on Bottom Layer: 8.89,5.91 8.89,4.97 9.71,4.97 10.92,3.75 14.38,3.75 14.38,5.17 15.47,6.25 15.47,7.73 14.26,7.73 14.26,6.66 13.48,5.89 8.91,5.89
$1N1257 on Bottom Layer: 10.16,7.18 9.02,7.18 9.02,8.56 10.05,9.59 10.05,10.47 11.71,10.47 11.71,9.49 11.56,9.34 10.59,9.34 10.16,8.9
$1N1258 on Top Layer: 12.24,9.09 13.68,9.09 13.68,7.75 12.24,7.75
$1N1258 on Bottom Layer: 8.89,6.93 8.89,6.04 10.42,6.04 11.66,7.28 13.77,7.28 13.77,9.09 10.47,9.09 10.47,7.1 10.29,6.93

Small or netless copper shapes (teardrops, artwork), in the pictures only: 3 on Top Layer, 18 on Bottom Layer

## Text on the board
Bottom Silkscreen Layer: 12V | 5V | 3.3V | GND
Top Silkscreen Layer: GND | 12V | 5V | 3.3V | VCC
